# EAGLE design musicbox-breakouts-01 (EAGLE 9.6.2)
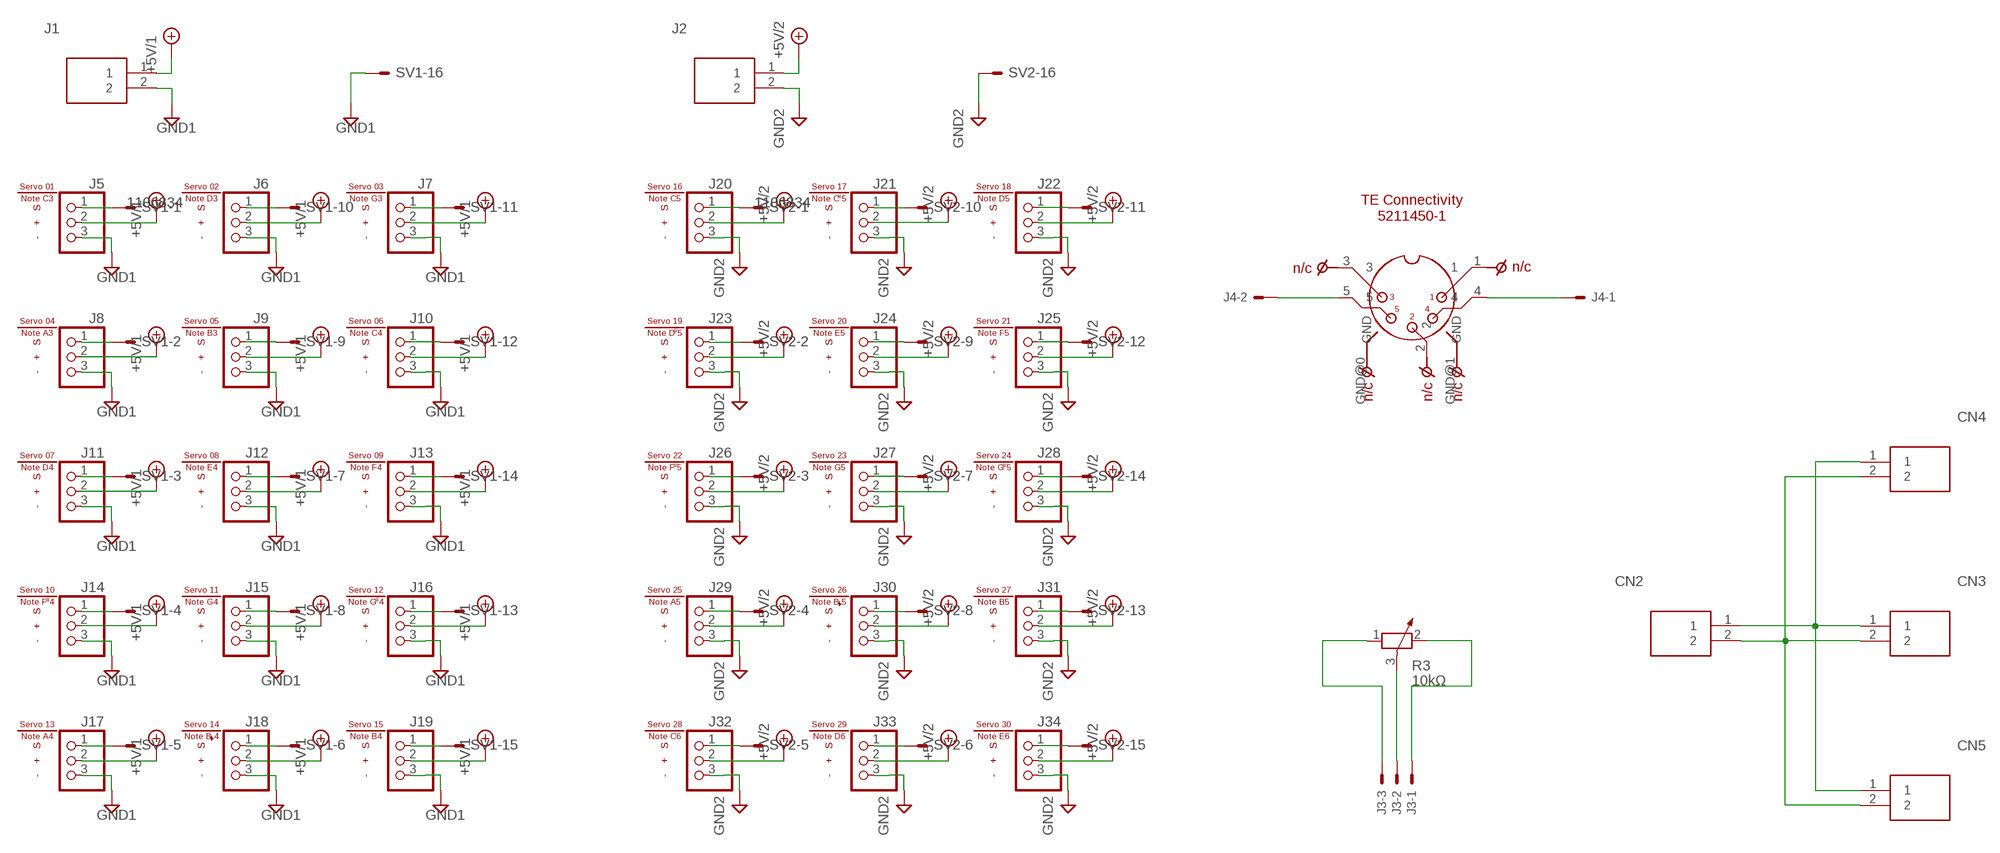
[diagram p0: schematic, sheet 1]

## Parts
CN1  5211450-1  [5211450-1]
CN2  1727010  [1727010]
CN3  1727010  [1727010]
CN4  1727010  [1727010]
CN5  1727010  [1727010]
J1  1727010  [1727010]
J2  1727010  [1727010]
J3  22-05-7038-03  [7395-03]
J4  22-27-2021-02  [6410-02]
J5  PINHD-1X3  [1X03]
J6  PINHD-1X3  [1X03]
J7  PINHD-1X3  [1X03]
J8  PINHD-1X3  [1X03]
J9  PINHD-1X3  [1X03]
J10  PINHD-1X3  [1X03]
J11  PINHD-1X3  [1X03]
J12  PINHD-1X3  [1X03]
J13  PINHD-1X3  [1X03]
J14  PINHD-1X3  [1X03]
J15  PINHD-1X3  [1X03]
J16  PINHD-1X3  [1X03]
J17  PINHD-1X3  [1X03]
J18  PINHD-1X3  [1X03]
J19  PINHD-1X3  [1X03]
J20  PINHD-1X3  [1X03]
J21  PINHD-1X3  [1X03]
J22  PINHD-1X3  [1X03]
J23  PINHD-1X3  [1X03]
J24  PINHD-1X3  [1X03]
J25  PINHD-1X3  [1X03]
J26  PINHD-1X3  [1X03]
J27  PINHD-1X3  [1X03]
J28  PINHD-1X3  [1X03]
J29  PINHD-1X3  [1X03]
J30  PINHD-1X3  [1X03]
J31  PINHD-1X3  [1X03]
J32  PINHD-1X3  [1X03]
J33  PINHD-1X3  [1X03]
J34  PINHD-1X3  [1X03]
R3  10kΩ  POTENTIOMETER_PT-10  [PT-10]
SV1  ML16E  [ML16]
SV2  ML16E  [ML16]
U$1  SERVO-SMALL  [SERVO-SMALL]
U$2  SERVO-SMALL  [SERVO-SMALL]
U$3  SERVO-SMALL  [SERVO-SMALL]
U$4  SERVO-SMALL  [SERVO-SMALL]
U$5  SERVO-SMALL  [SERVO-SMALL]
U$6  SERVO-SMALL  [SERVO-SMALL]
U$7  SERVO-SMALL  [SERVO-SMALL]
U$8  SERVO-SMALL  [SERVO-SMALL]
U$9  SERVO-SMALL  [SERVO-SMALL]
U$10  SERVO-SMALL  [SERVO-SMALL]
U$11  SERVO-SMALL  [SERVO-SMALL]
U$12  SERVO-SMALL  [SERVO-SMALL]
U$13  SERVO-SMALL  [SERVO-SMALL]
U$14  SERVO-SMALL  [SERVO-SMALL]
U$15  SERVO-SMALL  [SERVO-SMALL]
U$16  SERVO-SMALL  [SERVO-SMALL]
U$17  SERVO-SMALL  [SERVO-SMALL]
U$18  SERVO-SMALL  [SERVO-SMALL]
U$19  SERVO-SMALL  [SERVO-SMALL]
U$20  SERVO-SMALL  [SERVO-SMALL]
U$21  SERVO-SMALL  [SERVO-SMALL]
U$22  SERVO-SMALL  [SERVO-SMALL]
U$23  SERVO-SMALL  [SERVO-SMALL]
U$24  SERVO-SMALL  [SERVO-SMALL]
U$25  SERVO-SMALL  [SERVO-SMALL]
U$26  SERVO-SMALL  [SERVO-SMALL]
U$27  SERVO-SMALL  [SERVO-SMALL]
U$28  SERVO-SMALL  [SERVO-SMALL]
U$29  SERVO-SMALL  [SERVO-SMALL]
U$30  SERVO-SMALL  [SERVO-SMALL]
U$35  N/C-ALT-WITH-TEXT  (no package)
U$36  N/C-ALT-WITH-TEXT  (no package)
U$37  N/C-ALT-WITH-TEXT  (no package)
U$38  N/C-ALT-WITH-TEXT  (no package)
U$39  N/C-ALT-WITH-TEXT  (no package)
U$41  SERVO01_NOTEC3  [SERVO_1/NOTE_C3]
U$42  SERVO02_NOTED3  [SERVO_2/NOTE_D3]
U$43  SERVO03_NOTEG3  [SERVO_3/NOTE_G3]
U$44  SERVO04_NOTEA3  [SERVO_4/NOTE_A3]
U$45  SERVO05_NOTEB3  [SERVO_5/NOTE_B3]
U$46  SERVO06_NOTEC4  [SERVO_6/NOTE_C4]
U$47  SERVO07_NOTED4  [SERVO_7/NOTE_D4]
U$48  SERVO08_NOTEE4  [SERVO_8/NOTE_E4]
U$49  SERVO09_NOTEF4  [SERVO_9/NOTE_F4]
U$50  SERVO10_NOTEF#4  [SERVO_10/NOTE_F#4]
U$51  SERVO11_NOTEG4  [SERVO_11/NOTE_G4]
U$52  SERVO12_NOTEG#4  [SERVO_12/NOTE_G#4]
U$53  SERVO13_NOTEA4  [SERVO_13/NOTE_A4]
U$54  SERVO14_NOTEBB4  [SERVO_14/NOTE_BB4]
U$55  SERVO15_NOTEB4  [SERVO_15/NOTE_B4]
U$56  SERVO16_NOTEC5  [SERVO_16/NOTE_C5]
U$57  SERVO17_NOTEC#5  [SERVO_17/NOTE_C#5]
U$58  SERVO18_NOTED5  [SERVO_18/NOTE_D5]
U$59  SERVO19_NOTED#5  [SERVO_19/NOTE_D#5]
U$60  SERVO20_NOTEE5  [SERVO_20/NOTE_E5]
U$61  SERVO21_NOTEF5  [SERVO_21/NOTE_F5]
U$62  SERVO22_NOTEF#5  [SERVO_22/NOTE_F#5]
U$63  SERVO23_NOTEG5  [SERVO_23/NOTE_G5]
U$64  SERVO24_NOTEG#5  [SERVO_24/NOTE_G#5]
U$65  SERVO25_NOTEA5  [SERVO_25/NOTE_A5]
U$66  SERVO26_NOTEBB5  [SERVO_26/NOTE_BB5]
U$67  SERVO27_NOTEB5  [SERVO_27/NOTE_B5]
U$69  SERVO28_NOTEC6  [SERVO_28/NOTE_C6]
U$70  SERVO29_NOTED6  [SERVO_29/NOTE_D6]
U$71  SERVO30_NOTEE6  [SERVO_30/NOTE_E6]

## Nets
+5V [pwr]: J1.1 J5.2 J6.2 J7.2 J8.2 J9.2 J10.2 J11.2 J12.2 J13.2 J14.2 J15.2 J16.2 J17.2 J18.2 J19.2 ; supply symbol labelled +5V/1
GND [pwr]: J1.2 J5.3 J6.3 J7.3 J8.3 J9.3 J10.3 J11.3 J12.3 J13.3 J14.3 J15.3 J16.3 J17.3 J18.3 J19.3 SV1.16 ; supply symbol labelled GND1
N$1: J5.1 SV1.1
N$2: J8.1 SV1.2
N$3: J11.1 SV1.3
N$4: J14.1 SV1.4
N$5: J17.1 SV1.5
N$6: J16.1 SV1.13
N$7: J19.1 SV1.15
N$8: J13.1 SV1.14
N$9: J10.1 SV1.12
N$10: J7.1 SV1.11
N$11: J6.1 SV1.10
N$12: J9.1 SV1.9
N$13: J12.1 SV1.7
N$14: J15.1 SV1.8
N$15: J18.1 SV1.6
N$16: J20.1 SV2.1
N$17: J21.1 SV2.10
N$18: J22.1 SV2.11
N$19: J24.1 SV2.9
N$20: J23.1 SV2.2
N$21: J25.1 SV2.12
N$22: J26.1 SV2.3
N$23: J27.1 SV2.7
N$24: J28.1 SV2.14
N$25: J29.1 SV2.4
N$26: J30.1 SV2.8
N$27: J31.1 SV2.13
N$28: J32.1 SV2.5
N$29: J33.1 SV2.6
N$30: J34.1 SV2.15
N$31: CN2.1 CN3.1 CN4.1 CN5.1
N$32: CN2.2 CN3.2 CN4.2 CN5.2
N$56: J3.3 R3.1
N$57: J3.2 R3.3
N$58: J3.1 R3.2
N$59: CN1.4 J4.1
N$60: CN1.5 J4.2
N$61: CN1.3 U$35.P$1
N$62: CN1.1 U$36.P$1
N$63: CN1.GND@0(GND) U$37.P$1
N$64: CN1.GND@1(GND) U$39.P$1
N$65: CN1.2 U$38.P$1
VCC [pwr]: J2.1 J20.2 J21.2 J22.2 J23.2 J24.2 J25.2 J26.2 J27.2 J28.2 J29.2 J30.2 J31.2 J32.2 J33.2 J34.2 ; supply symbol labelled +5V/2
VSS [pwr]: J2.2 J20.3 J21.3 J22.3 J23.3 J24.3 J25.3 J26.3 J27.3 J28.3 J29.3 J30.3 J31.3 J32.3 J33.3 J34.3 SV2.16 ; supply symbol labelled GND2

## Notes on the sheet
- TE Connectivity
  5211450-1

## Library data of the parts
CN1 = 5211450-1:5211450-1: TE Connectivity 5211450-1 DIN 5P Connector Datasheet PDF: here <https://www.te.com/commerce/DocumentDelivery/DDEController?Action=srchrtrv&DocNm=5211450&DocType=Customer+Drawing&DocLang=English&PartCntxt=5211450-1&DocFormat=pdf>; DIGIKEY_PART_NUMBER: 5211450-1-ND; MANUFACTURER_NAME: TE Connectivity; MOUSER_PART_NUMBER: 571-5211450-1
CN2-CN5 J1 J2 = 1727010:1727010: Conn PC Terminal Block 2 POS 3.81mm Solder ST Thru-Hole 13.5A Source: Datasheet <https://datasheet.datasheetarchive.com/originals/distributors/SFDatasheet-2/sf-00050638.pdf>; ARROW_PART_NUMBER: 1727010; ARROW_PRICE-STOCK: https://www.arrow.com/en/products/1727010/phoenix-contact?region=nac; DESCRIPTION: Conn PC Terminal Block 2 POS 3.81mm Solder ST Thru-Hole 13.5A; DIGIKEY_PART_NUMBER: 277-1947-ND; FARNELL_PART_NUMBER: 3704579; HEIGHT: 8.65mm; MANUFACTURER_NAME: Phoenix Contact; MANUFACTURER_PART_NUMBER: 1727010; MOUSER_PART_NUMBER: 651-1727010; MOUSER_PRICE-STOCK: https://www.mouser.co.uk/ProductDetail/Phoenix-Contact/1727010?qs=JcjeNNoqGSMjtHhQoBJ7UA%3D%3D
J3 = con-molex:22-?-03: CONNECTOR wire to board 2.54 mm (.1 inch) pitch header; DIGIKEY_PART_NUMBER: WM2785-ND; FARNELL_PART_NUMBER: 9731610; MANUFACTURER_NAME: Molex; MF: MOLEX; MOUSER_PART_NUMBER: 538-22-05-7038; OC_FARNELL: unknown; OC_NEWARK: unknown
J4 = con-molex:22-?-02: CONNECTOR wire to board 2.54 mm (.1 inch) pitch header; DIGIKEY_PART_NUMBER: WM4111-ND; FARNELL_PART_NUMBER: 9731148; MANUFACTURER_NAME: Molex; MF: MOLEX; MOUSER_PART_NUMBER: 538-22-27-2021; OC_FARNELL: unknown; OC_NEWARK: unknown
J5-J34 = pinhead:PINHD-1X3: PIN HEADER; DIGIKEY_PART_NUMBER: 68004-403-ND; FARNELL_PART_NUMBER: 3881564; MANUFACTURER_NAME: Amphenol FCI; MOUSER_PART_NUMBER: 649-1012937890301BLF
R3 = rcl:POTENTIOMETER_: Potentiometer; DIGIKEY_PART_NUMBER: 1993-PT10MV10-103A1010-PM-S-ND; MANUFACTURER_NAME: Amphenol Piher; MOUSER_PART_NUMBER: 531-PT10MV1103A11PMS; SPICEMODEL: POT; SPICEPREFIX: X
SV1 SV2 = con-harting-ml:ML16?E: HARTING; DIGIKEY_PART_NUMBER: 1195-1694-ND; FARNELL_PART_NUMBER: 1106834; MANUFACTURER_NAME: Harting; MOUSER_PART_NUMBER: 617-09185166324; OC_FARNELL: unknown; OC_NEWARK: unknown
U$1-U$30 = labels:SERVO-SMALL; BOM: EXCLUDE
U$35-U$39 = nc-pin:N/C-ALT-WITH-TEXT: N/C Symbol With Label With Pin-Leg Alternative Symbol Slash-Notation; _EXTERNAL_: n/c
U$41 = labels:SERVO01_NOTEC3; BOM: EXCLUDE
U$42 = labels:SERVO02_NOTED3; BOM: EXCLUDE
U$43 = labels:SERVO03_NOTEG3; BOM: EXCLUDE
U$44 = labels:SERVO04_NOTEA3; BOM: EXCLUDE
U$45 = labels:SERVO05_NOTEB3; BOM: EXCLUDE
U$46 = labels:SERVO06_NOTEC4; BOM: EXCLUDE
U$47 = labels:SERVO07_NOTED4; BOM: EXCLUDE
U$48 = labels:SERVO08_NOTEE4; BOM: EXCLUDE
U$49 = labels:SERVO09_NOTEF4; BOM: EXCLUDE
U$50 = labels:SERVO10_NOTEF#4; BOM: EXCLUDE
U$51 = labels:SERVO11_NOTEG4; BOM: EXCLUDE
U$52 = labels:SERVO12_NOTEG#4; BOM: EXCLUDE
U$53 = labels:SERVO13_NOTEA4; BOM: EXCLUDE
U$54 = labels:SERVO14_NOTEBB4; BOM: EXCLUDE
U$55 = labels:SERVO15_NOTEB4; BOM: EXCLUDE
U$56 = labels:SERVO16_NOTEC5; BOM: EXCLUDE
U$57 = labels:SERVO17_NOTEC#5; BOM: EXCLUDE
U$58 = labels:SERVO18_NOTED5; BOM: EXCLUDE
U$59 = labels:SERVO19_NOTED#5; BOM: EXCLUDE
U$60 = labels:SERVO20_NOTEE5; BOM: EXCLUDE
U$61 = labels:SERVO21_NOTEF5; BOM: EXCLUDE
U$62 = labels:SERVO22_NOTEF#5; BOM: EXCLUDE
U$63 = labels:SERVO23_NOTEG5; BOM: EXCLUDE
U$64 = labels:SERVO24_NOTEG#5; BOM: EXCLUDE
U$65 = labels:SERVO25_NOTEA5; BOM: EXCLUDE
U$66 = labels:SERVO26_NOTEBB5; BOM: EXCLUDE
U$67 = labels:SERVO27_NOTEB5; BOM: EXCLUDE
U$69 = labels:SERVO28_NOTEC6; BOM: EXCLUDE
U$70 = labels:SERVO29_NOTED6; BOM: EXCLUDE
U$71 = labels:SERVO30_NOTEE6; BOM: EXCLUDE

## Net classes
0 default: width 0.406 mm
1 pwr: width 0.965 mm, clearance 0.305 mm

## Board
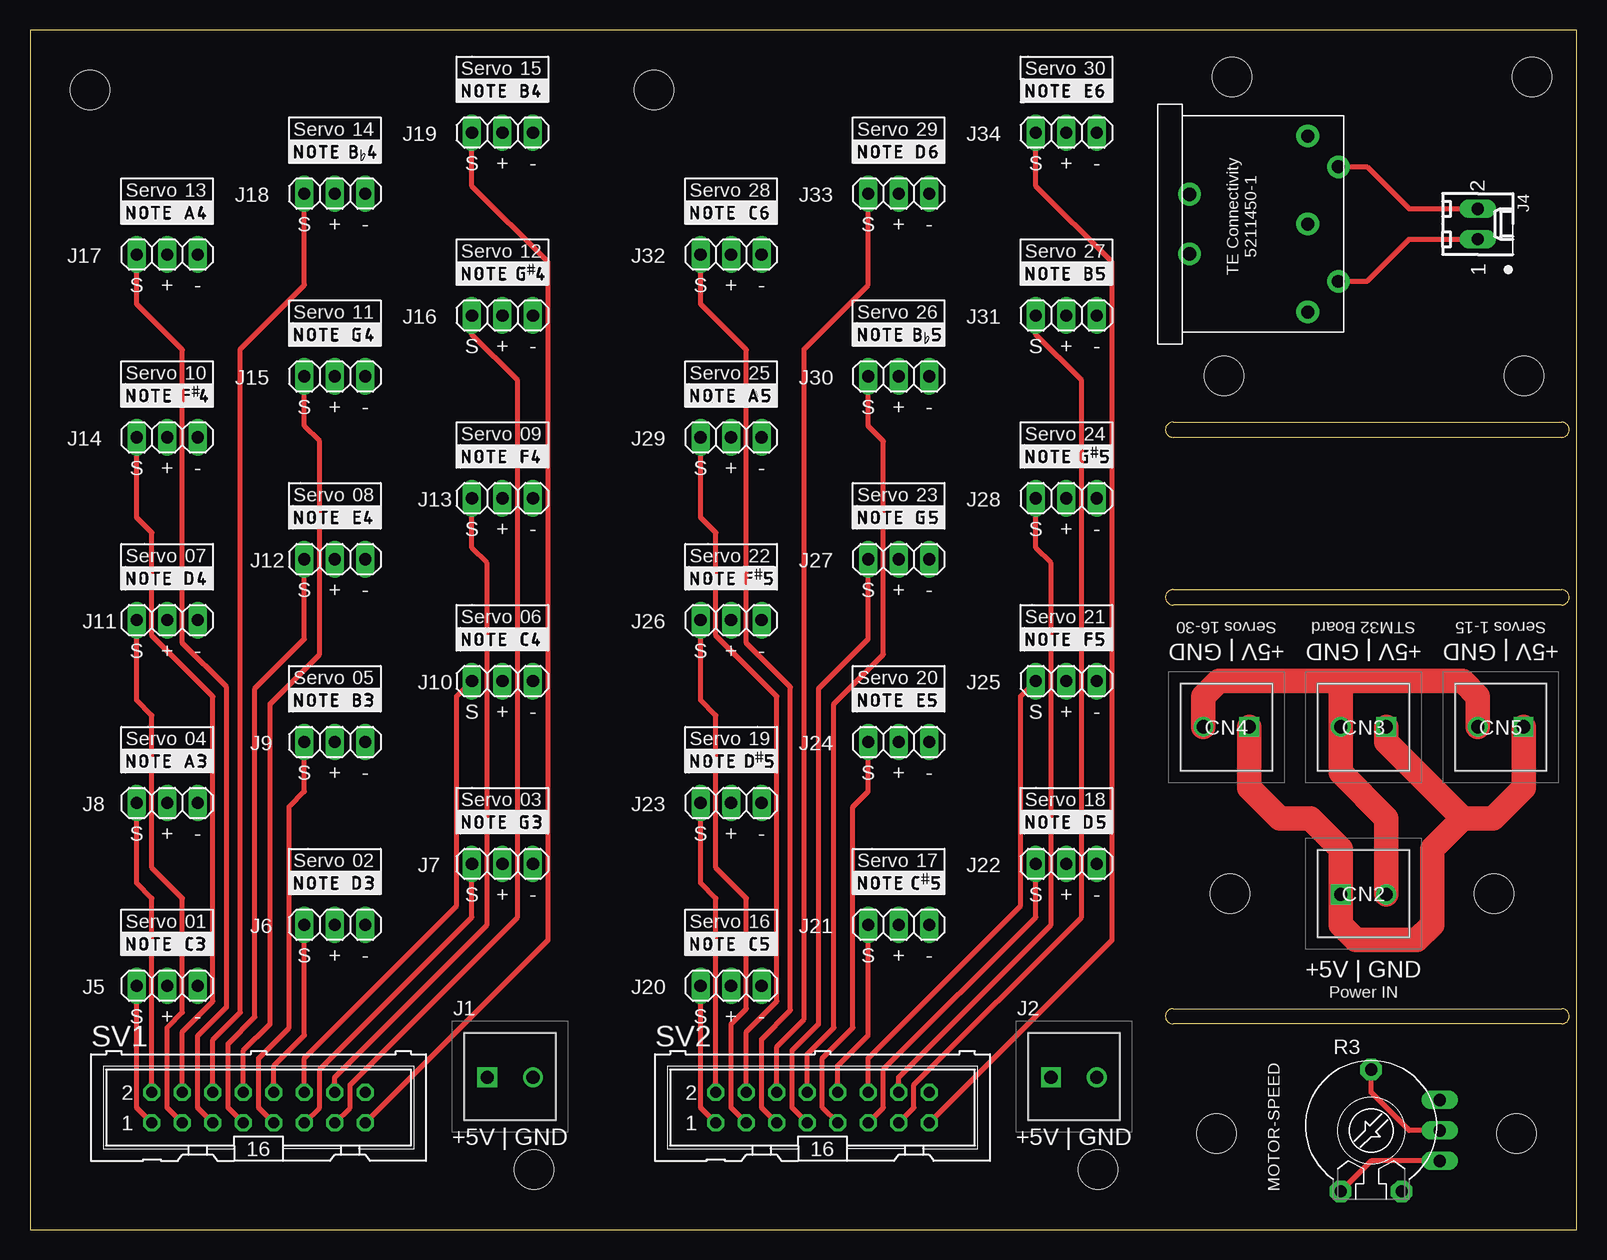
[diagram p1: board, top side]
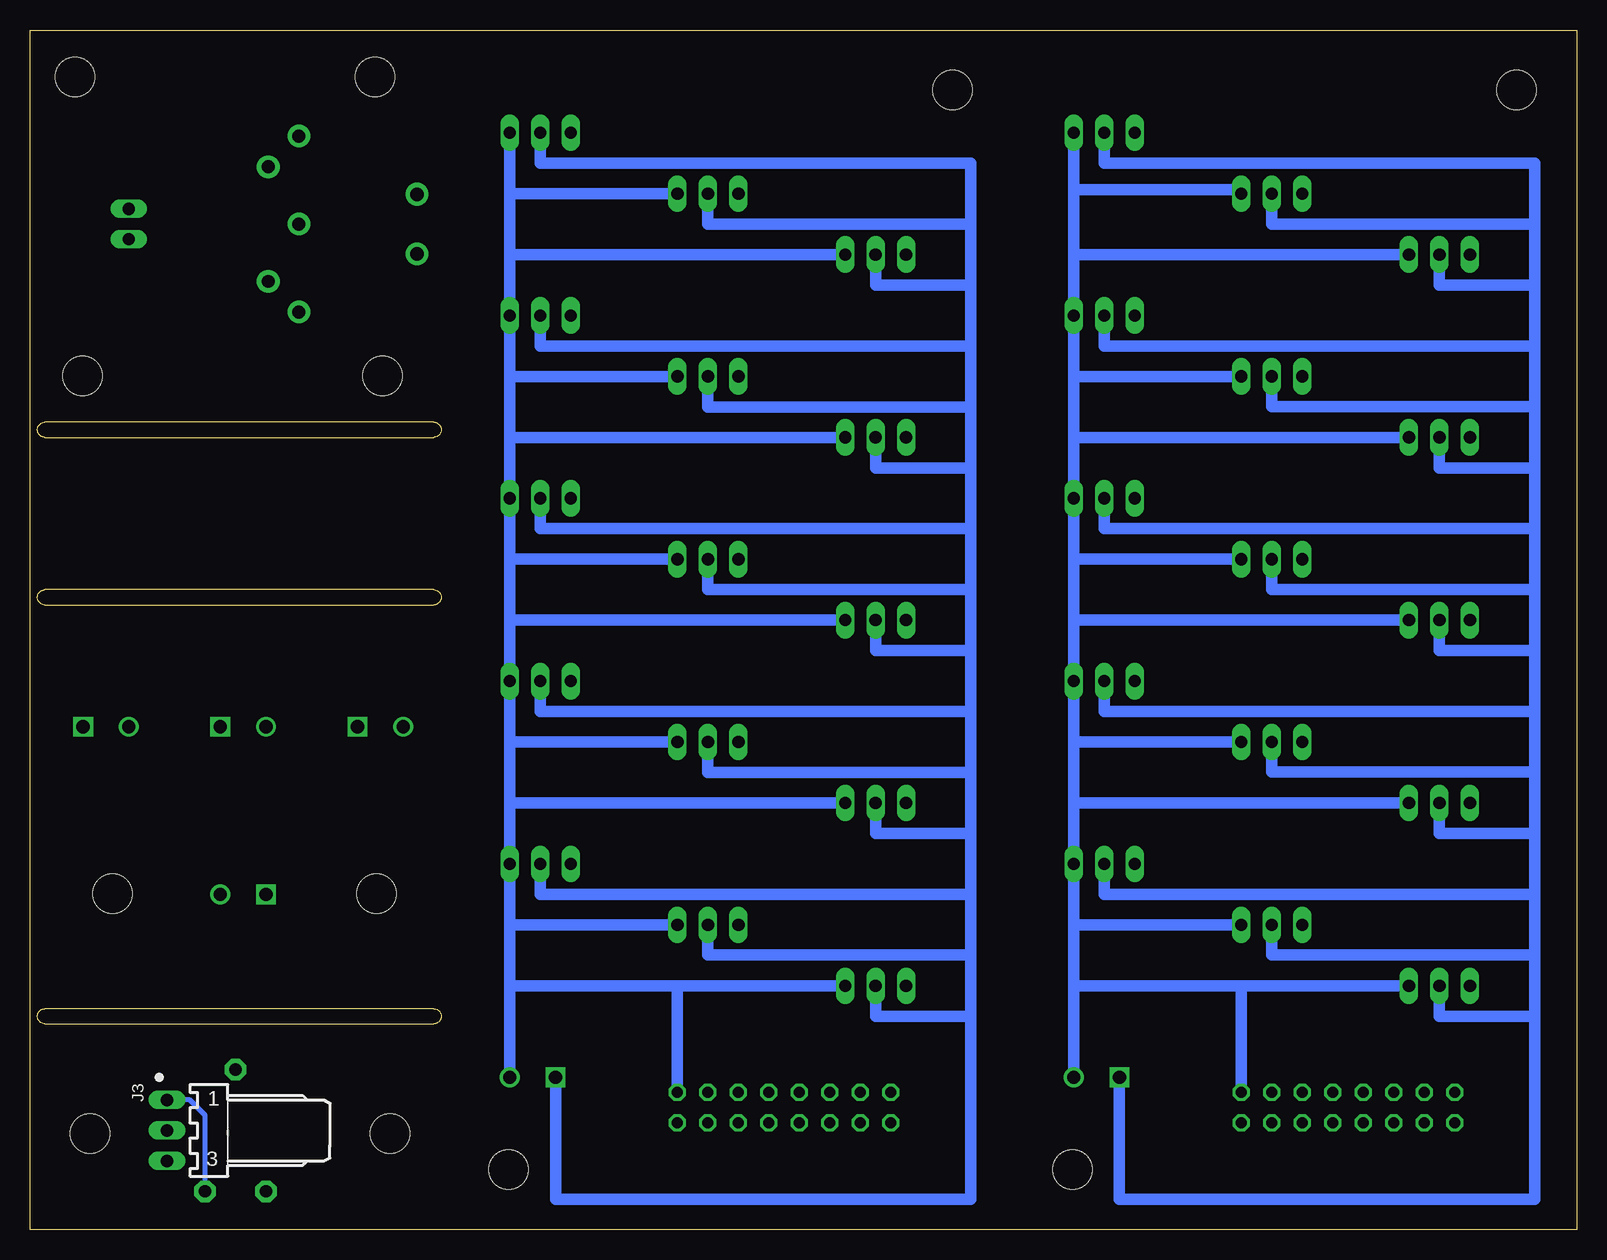
[diagram p2: board, bottom side, seen from below]

Size 128.88 x 100 mm. Coordinates in mm from the lower left corner, seen from the top.
Outline: 0,0 128.88,0 128.88,100 0,100 0,0
Outline: 95.25,67.31 arc180 95.25,66.04 127.64,66.04 arc180 127.64,67.31 95.25,67.31
Outline: 95.25,18.41 arc180 95.25,17.14 127.64,17.14 arc180 127.64,18.41 95.25,18.41
Outline: 95.25,53.34 arc180 95.25,52.07 127.64,52.07 arc180 127.64,53.34 95.25,53.34
Copper layers (1*16): Top 0.035mm / dielectric 1.5mm / Bottom 0.035mm
Design rules "default *": minimum track width 6mil, minimum drill 0.35mm, track to track 28mil, track to pad 12mil, pad to pad 6mil, via to via 6mil, smd to smd 6mil, copper to edge 40mil, drill to drill 6mil, minimum pad ring 10mil, minimum via ring 8mil, stop-mask expansion 4mil, vias tented up to drill 0mil, thermal gap 10mil
Holes 3.28 mm at 98.89,8 123.89,8 99.52,71.16 100.16,96.08 124.52,71.16 125.16,96.08 5,95 51.99,95 42,5 88.99,5 100,28 122,28

### Footprints (pad centres in the part's own frame; a part is rotated, then mirrored left to right if it is on the bottom)
5211450-1 = drill 1.07 pad 1.88: 1 7.334,12.5; 2 0,12.5; 3 -7.334,12.5; 4 4.776,15.049; 5 -4.776,15.049 | drill 1.13 pad 1.9: GND@0 -2.489,2.652; GND@1 2.489,2.652
1727010 = drill 1.1 pad 1.65 square: 1 0,0 | drill 1.1 pad 1.65: 2 3.81,0
7395-03 = drill 1.016 long: 1 2.54,0; 2 0,0; 3 -2.54,0
6410-02 = drill 1.016 long: 1 1.27,0; 2 -1.27,0
1X03 = drill 1.016 long: 1 -2.54,0; 2 0,0; 3 2.54,0
PT-10 = drill 1.016 pad 1.778 octagon: 1 -2.54,-5.08; 2 2.54,-5.08; 3 0,5.08
ML16 = drill 0.914 octagon: 1 -8.89,-1.27; 2 -8.89,1.27; 3 -6.35,-1.27; 4 -6.35,1.27; 5 -3.81,-1.27; 6 -3.81,1.27; 7 -1.27,-1.27; 8 -1.27,1.27; 9 1.27,-1.27; 10 1.27,1.27; 11 3.81,-1.27; 12 3.81,1.27; 13 6.35,-1.27; 14 6.35,1.27; 15 8.89,-1.27; 16 8.89,1.27

### Placement (x,y rotation side)
CN1  93.98,83.82 270 top
CN2  109.22,27.94 0 top
CN3  113.03,41.91 180 top
CN4  101.6,41.91 180 top
CN5  124.46,41.91 180 top
J1  38.1,12.7 0 top
J2  85.09,12.7 0 top
J3  117.47,8.26 90 bottom
J4  120.65,83.82 270 top
J5  11.43,20.32 0 top
J6  25.4,25.4 0 top
J7  39.37,30.48 0 top
J8  11.43,35.56 0 top
J9  25.4,40.64 0 top
J10  39.37,45.72 0 top
J11  11.43,50.8 0 top
J12  25.4,55.88 0 top
J13  39.37,60.96 0 top
J14  11.43,66.04 0 top
J15  25.4,71.12 0 top
J16  39.37,76.2 0 top
J17  11.43,81.28 0 top
J18  25.4,86.36 0 top
J19  39.37,91.44 0 top
J20  58.42,20.32 0 top
J21  72.39,25.4 0 top
J22  86.36,30.48 0 top
J23  58.42,35.56 0 top
J24  72.39,40.64 0 top
J25  86.36,45.72 0 top
J26  58.42,50.8 0 top
J27  72.39,55.88 0 top
J28  86.36,60.96 0 top
J29  58.42,66.04 0 top
J30  72.39,71.12 0 top
J31  86.36,76.2 0 top
J32  58.42,81.28 0 top
J33  72.39,86.36 0 top
J34  86.36,91.44 0 top
R3  111.76,8.26 0 top
SV1  19.05,10.16 0 top
SV2  66.04,10.16 0 top
U$1  11.43,48.26 0 top
U$2  39.37,43.18 0 top
U$3  58.42,17.78 0 top
U$4  86.36,27.94 0 top
U$5  86.36,43.18 0 top
U$6  11.43,33.02 0 top
U$7  25.4,68.58 0 top
U$8  39.37,58.42 0 top
U$9  58.42,33.02 0 top
U$10  72.39,22.86 0 top
U$11  86.36,88.9 0 top
U$12  72.39,53.34 0 top
U$13  25.4,83.82 0 top
U$14  39.37,73.66 0 top
U$15  25.4,22.86 0 top
U$16  58.42,78.74 0 top
U$17  72.39,38.1 0 top
U$18  86.36,58.42 0 top
U$19  11.43,78.74 0 top
U$20  39.37,88.9 0 top
U$21  39.37,27.94 0 top
U$22  58.42,63.5 0 top
U$23  72.39,83.82 0 top
U$24  86.36,73.66 0 top
U$25  11.43,63.5 0 top
U$26  25.4,53.34 0 top
U$27  25.4,38.1 0 top
U$28  58.42,48.26 0 top
U$29  72.39,68.58 0 top
U$30  11.43,17.78 0 top
U$41  14.29,26.35 0 top
U$42  28.26,31.43 0 top
U$43  42.23,36.51 0 top
U$44  14.29,41.59 0 top
U$45  28.26,46.67 0 top
U$46  42.23,51.75 0 top
U$47  14.29,56.83 0 top
U$48  28.26,61.91 0 top
U$49  42.23,66.99 0 top
U$50  14.29,72.07 0 top
U$51  28.26,77.15 0 top
U$52  42.23,82.23 0 top
U$53  14.29,87.31 0 top
U$54  28.26,92.39 0 top
U$55  42.23,97.47 0 top
U$56  61.28,26.35 0 top
U$57  75.25,31.43 0 top
U$58  89.22,36.51 0 top
U$59  61.28,41.59 0 top
U$60  75.25,46.67 0 top
U$61  89.22,51.75 0 top
U$62  61.28,56.83 0 top
U$63  75.25,61.91 0 top
U$64  89.22,66.99 0 top
U$65  61.28,72.07 0 top
U$66  75.25,77.15 0 top
U$67  89.22,82.23 0 top
U$69  61.28,87.31 0 top
U$70  75.25,92.39 0 top
U$71  89.22,97.47 0 top

### Tracks (layer width: path | path; a pad name or v marks a point on that pad's centre or on a via)
+5V
  Bottom 0.965: 3.49,38.12 3.49,33.02 | 3.49,33.02 3.49,27.62 | 3.49,27.62 3.49,22.89 | 3.49,52.7 3.49,53.37 25.4,53.37 J12.2 | 3.49,52.7 3.49,48.26 | 3.49,48.26 3.49,43.18 | 3.49,43.18 3.49,38.12 | 3.49,68.61 3.49,63.5 | 3.49,63.5 3.49,58.42 | 3.49,58.42 3.49,52.7 | J18.2 25.4,83.8 3.49,83.8 | 3.49,83.8 3.49,78.74 | 3.49,78.74 3.49,73.66 | 3.49,73.66 3.49,68.61 | J1.1 38.1,2.54 3.49,2.54 3.49,17.78 | 3.49,22.89 3.49,17.78 | J5.2 11.43,17.78 3.49,17.78 | J8.2 11.43,33.02 3.49,33.02 | J11.2 11.43,48.26 3.49,48.26 | J14.2 11.43,63.5 3.49,63.5 | J17.2 11.43,78.74 3.49,78.74 | J19.2 39.37,88.9 3.49,88.9 3.49,83.8 | J16.2 39.37,73.66 3.49,73.66 | J13.2 39.37,58.42 3.49,58.42 | J10.2 39.37,43.18 3.49,43.18 | J7.2 39.37,27.94 3.49,27.94 3.49,27.62 | J6.2 25.4,22.89 3.49,22.89 | J9.2 25.4,38.12 3.49,38.12 | J15.2 25.4,68.61 3.49,68.61
GND
  Bottom 0.965: J1.2 41.91,20.32 | 41.91,20.32 41.91,25.4 | 41.91,25.4 J7.3 41.91,35.56 | 41.91,35.56 41.91,40.64 | 41.91,40.64 J10.3 41.91,50.8 | 41.91,50.8 41.91,55.88 | 41.91,55.88 J13.3 41.91,66.04 | 41.91,66.04 41.91,70.8 | 41.91,70.8 J16.3 41.91,80.96 | 41.91,80.96 41.91,86.68 | 41.91,86.68 J19.3 | J18.3 27.94,86.68 41.91,86.68 | J17.3 41.91,81.28 41.91,80.96 | J15.3 41.91,71.12 41.91,70.8 | J14.3 41.91,66.04 | J12.3 41.91,55.88 | J11.3 41.91,50.8 | J9.3 41.91,40.64 | J8.3 41.91,35.56 | J6.3 41.91,25.4 | J5.3 27.94,20.32 | 27.94,20.32 41.91,20.32 | SV1.16 27.94,20.32
N$1
  Top 0.406: SV1.1 8.89,10.16 J5.1
N$2
  Top 0.406: SV1.2 10.16,27.62 8.89,28.89 J8.1
N$3
  Top 0.406: SV1.3 11.43,10.16 11.43,16.83 12.7,18.1 12.7,27.62 10.16,30.16 10.16,42.86 8.89,44.13 J11.1
N$4
  Top 0.406: J14.1 8.89,59.37 10.16,58.1 10.16,49.51 15.24,44.43 15.24,19.03 12.7,16.49 SV1.4
N$5
  Top 0.406: SV1.5 13.97,10.16 13.97,16.13 16.38,18.54 16.38,45.21 12.7,48.9 12.7,73.34 8.89,77.15 J17.1
N$6
  Top 0.406: SV1.13 26.67,10.16 26.67,12.06 40.64,26.04 40.64,70.8 36.83,74.61 J16.1
N$7
  Top 0.406: SV1.15 43.18,24.13 43.18,80.64 36.83,87 J19.1
N$8
  Top 0.406: SV1.14 25.4,12.7 38.1,25.4 38.1,55.56 36.83,56.83 J13.1
N$9
  Top 0.406: J10.1 35.56,44.45 35.56,26.99 22.86,14.29 SV1.12
N$10
  Top 0.406: SV1.11 24.13,10.16 24.13,13.34 36.83,26.04 J7.1
N$11
  Top 0.406: SV1.10 20.32,13.65 22.86,16.19 J6.1
N$12
  Top 0.406: SV1.9 19.05,10.16 19.05,14.29 21.59,16.83 21.59,35.24 22.86,36.51 J9.1
N$13
  Top 0.406: SV1.7 16.51,10.16 16.51,15.49 18.73,17.72 18.73,45.09 22.86,49.21 J12.1
N$14
  Top 0.406: SV1.8 17.78,14.92 20,17.14 20,43.81 24.13,47.94 24.13,65.72 22.86,66.99 J15.1
N$15
  Top 0.406: SV1.6 15.24,15.81 17.53,18.1 17.53,73.41 22.86,78.74 J18.1
N$16
  Top 0.406: SV2.1 55.88,10.16 J20.1
N$17
  Top 0.406: SV2.10 67.31,13.65 69.85,16.19 J21.1
N$18
  Top 0.406: SV2.11 71.12,10.16 71.12,13.34 83.82,26.04 J22.1
N$19
  Top 0.406: SV2.9 66.04,10.16 66.04,14.29 68.58,16.83 68.58,35.24 69.85,36.51 J24.1
N$20
  Top 0.406: SV2.2 57.15,27.62 55.88,28.89 J23.1
N$21
  Top 0.406: SV2.12 69.85,14.29 82.55,26.99 82.55,44.45 J25.1
N$22
  Top 0.406: SV2.3 58.42,10.16 58.42,17.14 59.69,18.41 59.69,27.62 57.15,30.16 57.15,42.86 55.88,44.13 J26.1
N$23
  Top 0.406: SV2.7 63.5,10.16 63.5,14.92 65.72,17.14 65.72,45.09 69.85,49.21 J27.1
N$24
  Top 0.406: SV2.14 72.39,12.7 85.09,25.4 85.09,55.56 83.82,56.83 J28.1
N$25
  Top 0.406: J29.1 55.88,59.37 57.15,58.1 57.15,49.51 57.89,48.77 57.91,48.77 62.23,44.45 62.23,19.03 59.69,16.49 SV2.4
N$26
  Top 0.406: SV2.8 64.77,14.61 66.99,16.83 66.99,43.81 71.12,47.94 71.12,65.72 69.85,66.99 J30.1
N$27
  Top 0.406: SV2.13 73.66,10.16 73.66,12.06 87.63,26.04 87.63,70.8 83.82,74.61 J31.1
N$28
  Top 0.406: SV2.5 60.96,10.16 60.96,15.88 63.37,18.29 63.37,45.21 59.69,48.9 59.69,73.34 55.88,77.15 J32.1
N$29
  Top 0.406: SV2.6 62.23,15.24 64.52,17.53 64.52,73.41 69.85,78.74 J33.1
N$30
  Top 0.406: SV2.15 90.17,24.13 90.17,80.64 83.82,87 J34.1
N$31
  Top 2.032: CN4.1 101.6,36.83 104.14,34.29 106.68,34.29 109.22,31.75 CN2.1 109.22,25.4 110.49,24.13 115.57,24.13 116.84,25.4 116.84,31.75 119.38,34.29 | CN5.1 124.46,36.83 121.92,34.29 119.38,34.29 | CN3.1 113.03,40.64 119.38,34.29
N$32
  Top 2.032: 109.22,45.72 CN3.2 109.22,38.1 113.03,34.29 CN2.2 | CN4.2 97.79,44.45 99.06,45.72 109.22,45.72 | CN5.2 120.65,44.45 119.38,45.72 109.22,45.72
N$56
  Top 0.406: J3.3 111.76,5.71 R3.1
N$57
  Top 0.406: J3.2 114.94,8.26 111.76,11.43 R3.3
N$58
  Bottom 0.406: R3.2 114.3,9.53 115.57,10.79 J3.1
N$59
  Top 0.406: CN1.4 111.43,79.04 114.94,82.55 J4.1
N$60
  Top 0.406: CN1.5 111.43,88.6 114.94,85.09 J4.2
VCC
  Bottom 0.965: J2.1 85.09,2.54 50.48,2.54 50.48,17.78 | J20.2 58.42,17.78 50.48,17.78 | J23.2 58.42,33.02 50.48,33.02 | 50.48,33.02 50.48,28.26 | 50.48,28.26 50.48,22.86 | 50.48,22.86 50.48,17.78 | J26.2 58.42,48.26 50.48,48.26 | 50.48,48.26 50.48,43.18 | 50.48,43.18 50.48,38.1 | 50.48,38.1 50.48,33.02 | J29.2 58.42,63.5 50.48,63.5 | 50.48,63.5 50.48,58.74 | 50.48,58.74 50.48,53.66 | 50.48,53.66 50.48,48.26 | J32.2 58.42,78.74 50.48,78.74 | 50.48,78.74 50.48,73.66 | 50.48,73.66 50.48,68.58 | 50.48,68.58 50.48,63.5 | J33.2 72.39,83.82 50.48,83.82 | 50.48,83.82 50.48,78.74 | J30.2 72.39,68.58 50.48,68.58 | J27.2 72.39,53.34 50.48,53.34 50.48,53.66 | J24.2 72.39,38.1 50.48,38.1 | J21.2 72.39,22.89 50.48,22.89 50.48,22.86 | J22.2 86.36,27.94 50.48,27.94 50.48,28.26 | J25.2 86.36,43.18 50.48,43.18 | J28.2 86.36,58.42 50.48,58.42 50.48,58.74 | J31.2 86.36,73.64 50.48,73.64 50.48,73.66 | J34.2 86.36,88.9 50.48,88.9 50.48,83.82
VSS
  Bottom 0.965: J2.2 88.9,20.32 | 88.9,20.32 88.9,25.4 | 88.9,25.4 J22.3 88.9,35.56 | 88.9,35.56 88.9,40.64 | 88.9,40.64 J25.3 88.9,50.8 | 88.9,50.8 88.9,56.2 | 88.9,56.2 J28.3 88.9,65.72 | 88.9,65.72 88.9,70.48 | 88.9,70.48 J31.3 88.9,81.28 | 88.9,81.28 88.9,86.36 | 88.9,86.36 J34.3 | J33.3 88.9,86.36 | J32.3 88.9,81.28 | J30.3 88.9,71.12 88.9,70.48 | J29.3 88.9,66.04 88.9,65.72 | J27.3 88.9,55.88 88.9,56.2 | J26.3 88.9,50.8 | J24.3 88.9,40.64 | J23.3 88.9,35.56 | J21.3 88.9,25.4 | J20.3 74.93,20.32 | 74.93,20.32 88.9,20.32 | SV2.16 74.93,20.32

### Text on the board
tNames: TE Connectivity / 5211450-1 | Servos 16-30 | STM32 Board | Servos 1-15 | +5V | GND | +5V | GND | +5V | GND | +5V | GND | Power IN | +5V | GND | +5V | GND | MOTOR-SPEED
VScore: V-Cut | V-Cut